# EAGLE schematic Adafruit Feather M0 RFMxx (EAGLE 9.6.2)
COMPANY: ADAFRUIT INDUSTRIES; DRAWN: KTOWN; REV: B
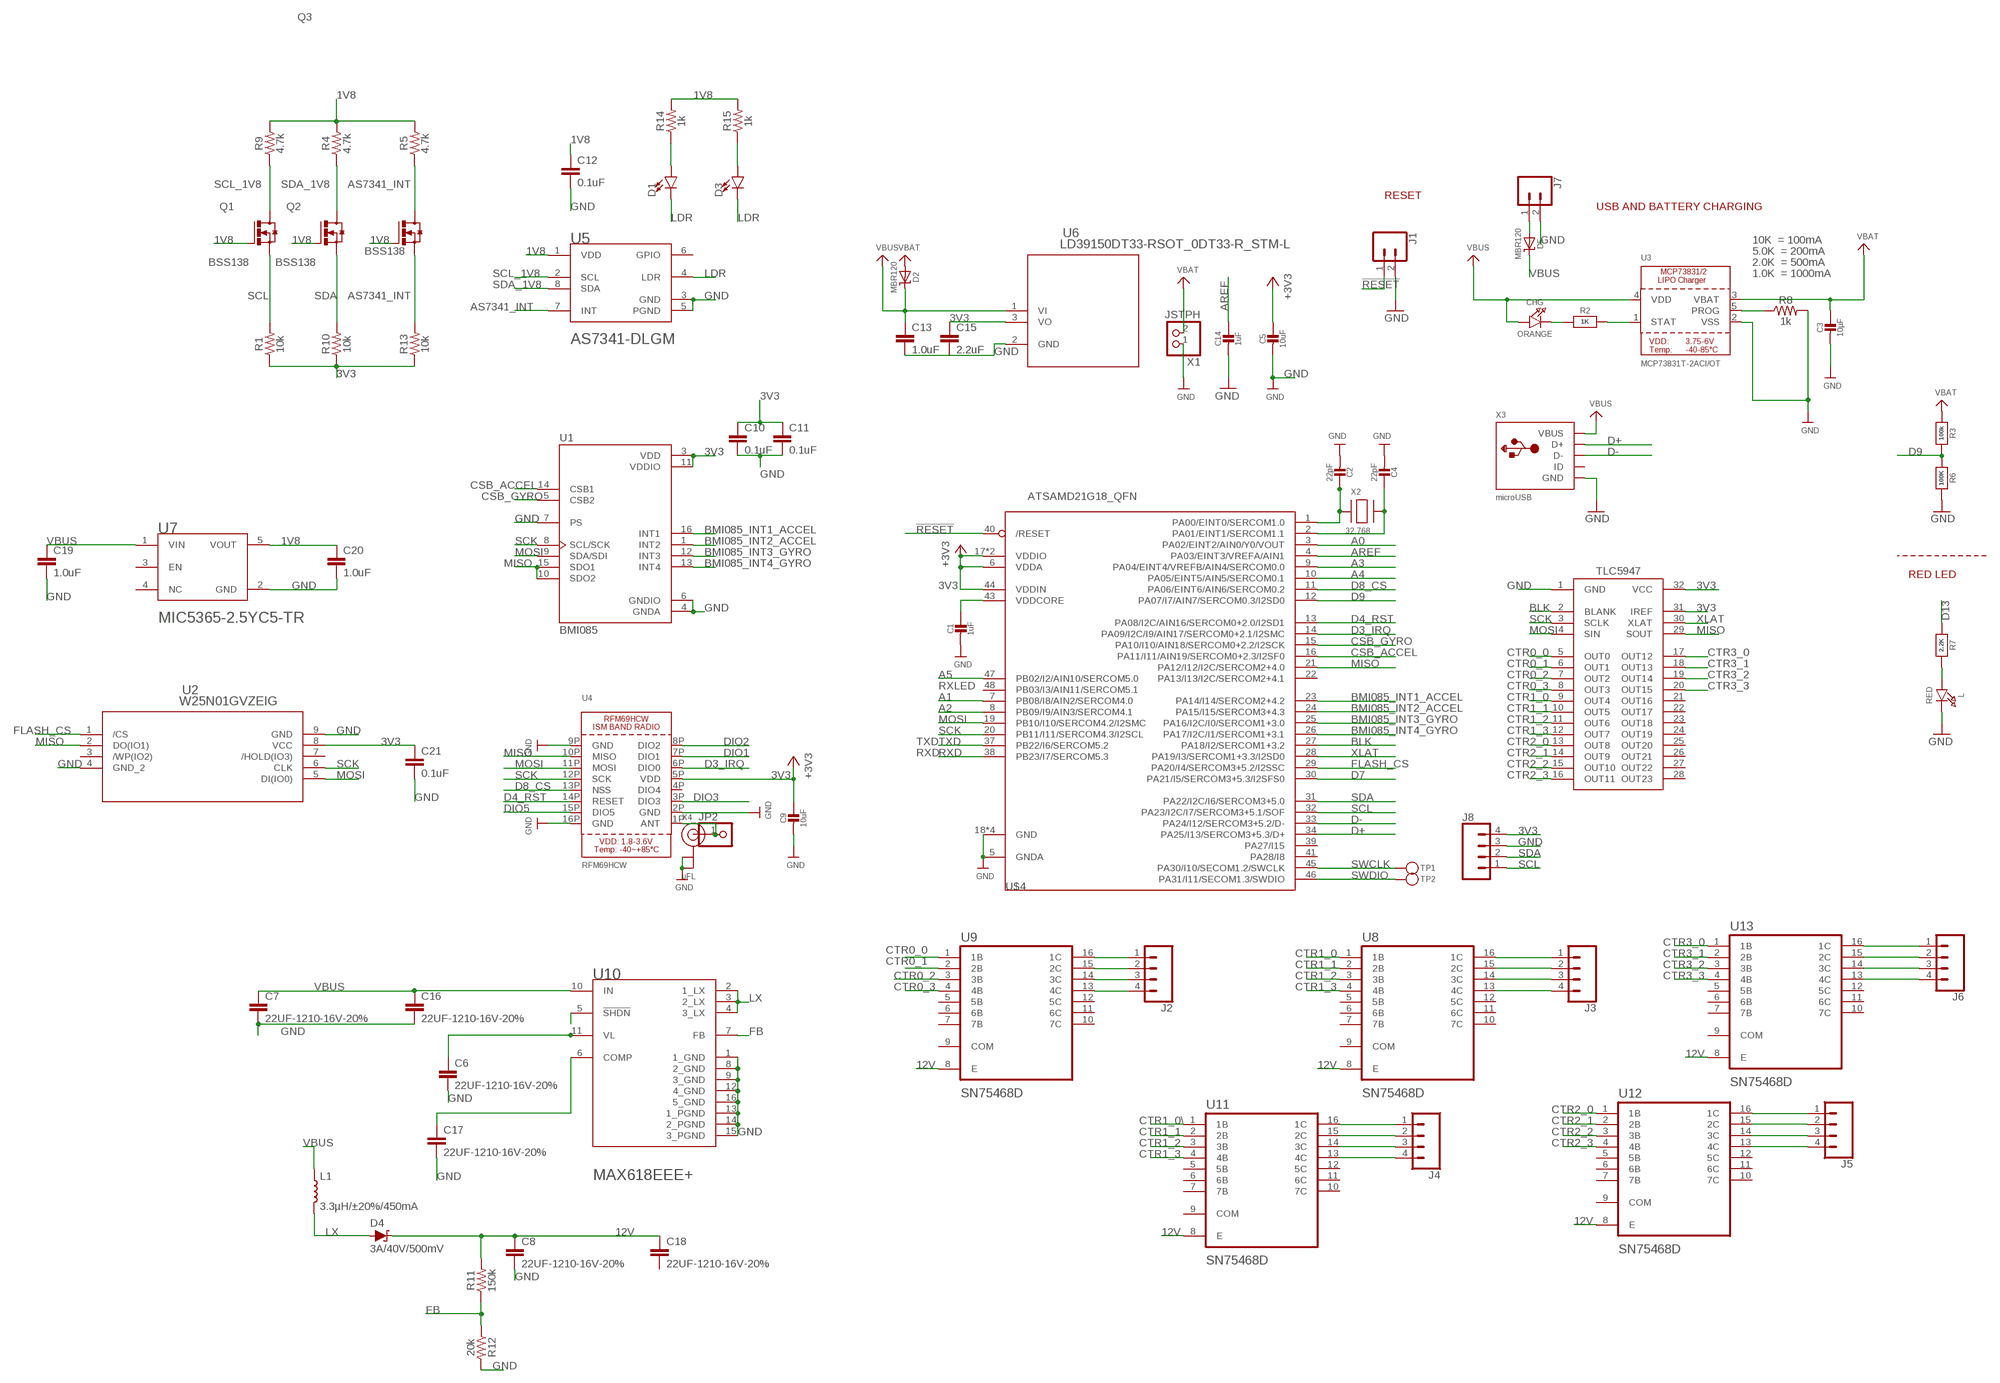
[diagram p0: schematic, sheet 1]

## Parts
C1  1uF  CAP_CERAMIC0603_NO  [0603-NO]
C2  22pF  CAP_CERAMIC0603_NO  [0603-NO]
C3  10µF  CAP_CERAMIC0805-NOOUTLINE  [0805-NO]
C4  22pF  CAP_CERAMIC0603_NO  [0603-NO]
C5  10uF  CAP_CERAMIC0805-NOOUTLINE  [0805-NO]
C6  22UF-1210-16V-20%  [1210]
C7  22UF-1210-16V-20%  [1210]
C8  22UF-1210-16V-20%  [1210]
C9  10uF  CAP_CERAMIC0805-NOOUTLINE  [0805-NO]
C10  0.1uF  0.1UF-0603-25V-5%  [0603]
C11  0.1uF  0.1UF-0603-25V-5%  [0603]
C12  0.1uF  0.1UF-0603-25V-5%  [0603]
C13  1.0uF  1.0UF-0805-25V-(+80/-20%)  [0805]
C14  1uF  CAP_CERAMIC0603_NO  [0603-NO]
C15  2.2uF  2.2UF-0805-25V-(+80/-20%)  [0805]
C16  22UF-1210-16V-20%  [1210]
C17  22UF-1210-16V-20%  [1210]
C18  22UF-1210-16V-20%  [1210]
C19  1.0uF  1.0UF-0805-25V-(+80/-20%)  [0805]
C20  1.0uF  1.0UF-0805-25V-(+80/-20%)  [0805]
C21  0.1uF  0.1UF-0603-100V-10%  [0603]
CHG  ORANGE  LED0805_NOOUTLINE  [CHIPLED_0805_NOOUTLINE]
D1  LED1206  [LED-1206]
D2  MBR120  DIODE-SCHOTTKYSOD-123  [SOD-123]
D3  LED1206  [LED-1206]
D4  3A/40V/500mV  DIODE-SCHOTTKY-B340A  [SMA-DIODE]
D5  MBR120  DIODE-SCHOTTKYSOD-123  [SOD-123]
IC1  TLC5947-DAP  [HTSSOP32DAP]
J1  CONN_02  [1X02]
J2  CONN_04  [1X04]
J3  CONN_04  [1X04]
J4  CONN_04  [1X04]
J5  CONN_04  [1X04]
J6  CONN_04  [1X04]
J7  CONN_02  [1X02]
J8  CONN_04  [1X04]
JP2  HEADER-1X1ROUND  [1X01_ROUND]
L  RED  LED0805_NOOUTLINE  [CHIPLED_0805_NOOUTLINE]
L1  3.3µH/±20%/450mA  INDUCTOR-0805-3.3UH  [0805]
Q1  BSS138  [SOT23-3]
Q2  BSS138  [SOT23-3]
Q3  BSS138  [SOT23-3]
R1  10k  10KOHM-0603-1/10W-1%  [0603]
R2  1K  RESISTOR_0603_NOOUT  [0603-NO]
R3  100k  RESISTOR_0603_NOOUT  [0603-NO]
R4  4.7k  4.7KOHM-0603-1/10W-1%  [0603]
R5  4.7k  4.7KOHM-0603-1/10W-1%  [0603]
R6  100K  RESISTOR_0603_NOOUT  [0603-NO]
R7  2.2K  RESISTOR_0603_NOOUT  [0603-NO]
R8  1k  1KOHM-0603-1/10W-1%  [0603]
R9  4.7k  4.7KOHM-0603-1/10W-1%  [0603]
R10  10k  10KOHM-0603-1/10W-1%  [0603]
R11  150k  150KOHM-0603-1/10W-1%  [0603]
R12  20k  20KOHM-0603-1/10W-1%  [0603]
R13  10k  10KOHM-0603-1/10W-1%  [0603]
R14  1k  1KOHM-0603-1/10W-1%  [0603]
R15  1k  1KOHM-0603-1/10W-1%  [0603]
TP1  TESTPOINTROUND1.5MM  [TESTPOINT_ROUND_1.5MM]
TP2  TESTPOINTROUND1.5MM  [TESTPOINT_ROUND_1.5MM]
U1  BMI085  [PQFN50P450X300X100-16N]
U2  W25N01GVZEIG  [WSON-8_6X5_WIN]
U3  MCP73831T-2ACI/OT  MCP73831/2  [SOT23-5]
U4  RFM69HCW  RFM69HCW_SMT  [RFMHCW_SMT]
U5  AMS_AS7341-DLGMAMS_AS7341-DLGM_0_0  [AMS_AS7341-DLGM_0]
U6  LD39150DT33-RSOT_0DT33-R_STM-L  [SOT_0DT33-R_STM-L]
U7  MICROCHIP_MIC5365-2_5YC5-TRMICROCHIP_MIC5365-2_5YC5-TR_0_0  [MICROCHIP_MIC5365-2_5YC5-TR_0]
U8  SN75468D  [SOIC127P600X175-16N]
U9  SN75468D  [SOIC127P600X175-16N]
U10  MAXIM_MAX618EEE+MAXIM_MAX618EEE+_0_0  [MAXIM_MAX618EEE+_0]
U11  SN75468D  [SOIC127P600X175-16N]
U12  SN75468D  [SOIC127P600X175-16N]
U13  SN75468D  [SOIC127P600X175-16N]
U$4  ATSAMD21G18_QFN  ATSAMD21J_QFN  [TQFN48_7MM]
X1  JSTPH  CON_JST_PH_2PIN  [JSTPH2]
X2  32.768  XTAL-3.2X1.5  [XTAL3215]
X3  microUSB  USB_MICRO_20329_V2  [4UCONN_20329_V2]
X4  uFL  ANTENNA_U.FL  [U.FL]

## Nets
1V8: C12.1 C20.1 Q1.1(G) Q2.1(G) Q3.1(G) R4.2 R5.2 R9.2 R14.2 R15.2 U5.1(VDD) U7.5(VOUT)
3V3: C5.1 C9.1 C10.1 C11.1 C15.1 C21.1 IC1.31(IREF) IC1.32(VCC) J8.4 R1.1 R10.1 R13.1 U1.3(VDD) U1.11(VDDIO) U2.8(VCC) U4.5P(VDD) U6.3(VO) U$4.6(VDDA) U$4.17(VDDIO) U$4.36(VDDIO) U$4.44(VDDIN) ; supply symbol labelled +3V3
12V: C8.1 C18.1 D4.C R11.2 U8.8(E) U9.8(E) U11.8(E) U12.8(E) U13.8(E)
!RESET: J1.1 U$4.40(/RESET)
A0: U$4.3(PA02/EINT2/AIN0/Y0/VOUT)
A1: U$4.7(PB08/I8/AIN2/SERCOM4.0)
A2: U$4.8(PB09/I9/AIN3/SERCOM4.1)
A3: U$4.9(PA04/EINT4/VREFB/AIN4/SERCOM0.0)
A4: U$4.10(PA05/EINT5/AIN5/SERCOM0.1)
A5: U$4.47(PB02/I2/AIN10/SERCOM5.0)
ANT: JP2.1 U4.1P(ANT) X4.3(SIGNAL)
AREF: C14.1 U$4.4(PA03/EINT3/VREFA/AIN1)
AS7341_INT: Q3.2(S) Q3.3(D) R5.1 R13.2 U5.7(INT)
BLK: IC1.2(BLANK) U$4.27(PA18/I2/SERCOM1+3.2)
BMI085_INT1_ACCEL: U1.16(INT1) U$4.23(PA14/I14/SERCOM2+4.2)
BMI085_INT2_ACCEL: U1.1(INT2) U$4.24(PA15/I15/SERCOM3+4.3)
BMI085_INT3_GYRO: U1.12(INT3) U$4.25(PA16/I2C/I0/SERCOM1+3.0)
BMI085_INT4_GYRO: U1.13(INT4) U$4.26(PA17/I2C/I1/SERCOM1+3.1)
CSB_ACCEL: U1.14(CSB1) U$4.16(PA11/I11/AIN19/SERCOM0+2.3/I2SF0)
CSB_GYRO: U1.5(CSB2) U$4.15(PA10/I10/AIN18/SERCOM0+2.2/I2SCK)
CTR0_0: IC1.5(OUT0) U9.1(1B)
CTR0_1: IC1.6(OUT1) U9.2(2B)
CTR0_2: IC1.7(OUT2) U9.3(3B)
CTR0_3: IC1.8(OUT3) U9.4(4B)
CTR1_0: IC1.9(OUT4) U8.1(1B)
CTR1_0\: U11.1(1B)
CTR1_1: IC1.10(OUT5) U8.2(2B) U11.2(2B)
CTR1_2: IC1.11(OUT6) U8.3(3B) U11.3(3B)
CTR1_3: IC1.12(OUT7) U8.4(4B) U11.4(4B)
CTR2_0: IC1.13(OUT8) U12.1(1B)
CTR2_1: IC1.14(OUT9) U12.2(2B)
CTR2_2: IC1.15(OUT10) U12.3(3B)
CTR2_3: IC1.16(OUT11) U12.4(4B)
CTR3_0: IC1.17(OUT12) U13.1(1B)
CTR3_1: IC1.18(OUT13) U13.2(2B)
CTR3_2: IC1.19(OUT14) U13.3(3B)
CTR3_3: IC1.20(OUT15) U13.4(4B)
D3_IRQ: U4.6P(DIO0) U$4.14(PA09/I2C/I9/AIN17/SERCOM0+2.1/I2SMC)
D4_RST: U4.14P(RESET) U$4.13(PA08/I2C/AIN16/SERCOM0+2.0/I2SD1)
D7: U$4.30(PA21/I5/SERCOM3+5.3/I2SFS0)
D8_CS: U4.13P(NSS) U$4.11(PA06/EINT6/AIN6/SERCOM0.2)
D9: R3.2 R6.1 U$4.12(PA07/I7/AIN7/SERCOM0.3/I2SD0)
D13: R7.1
D+: U$4.34(PA25/I13/SERCOM3+5.3/D+) X3.D+
D-: U$4.33(PA24/I12/SERCOM3+5.2/D-) X3.D-
DIO1: U4.7P(DIO1)
DIO2: U4.8P(DIO2)
DIO3: U4.3P(DIO3)
DIO5: U4.15P(DIO5)
FB: R11.1 R12.1 U10.7(FB)
FLASH_CS: U2.1(/CS) U$4.29(PA20/I4/SERCOM3+5.2/I2SSC)
GND: C1.2 C2.2 C3.2 C4.2 C5.2 C6.2 C7.2 C8.2 C9.2 C10.2 C11.2 C12.2 C13.2 C14.2 C15.2 C16.2 C17.2 C19.2 C20.2 C21.2 IC1.1(GND) J1.2 J7.2 J8.3 L.C R6.2 R8.2 R12.2 U1.4(GNDA) U1.6(GNDIO) U1.7(PS) U2.4(GND_2) U2.9(GND) U3.2(VSS) U4.2P(GND) U4.9P(GND) U4.16P(GND) U5.3(GND) U5.5(PGND) U6.2(GND) U7.2(GND) U10.1(1_GND) U10.8(2_GND) U10.9(3_GND) U10.12(4_GND) U10.13(1_PGND) U10.14(2_PGND) U10.15(3_PGND) U10.16(5_GND) U$4.5(GNDA) U$4.18(GND) U$4.35(GND) U$4.42(GND) U$4.THERMAL(GND) X1.1 X3.BASE@1(GND) X3.BASE@2(GND) X3.GND X3.SPRT@1(GND) X3.SPRT@2(GND) X3.SPRT@3(GND) X3.SPRT@4(GND) X4.1(GND) X4.2(GND)
LDR: D1.C D3.C U5.4(LDR)
LX: D4.A L1.2 U10.2(1_LX) U10.3(2_LX) U10.4(3_LX)
MISO: IC1.29(SOUT) U1.10(SDO2) U1.15(SDO1) U2.2(DO(IO1)) U4.10P(MISO) U$4.21(PA12/I12/I2C/SERCOM2+4.0)
MOSI: IC1.4(SIN) U1.9(SDA/SDI) U2.5(DI(IO0)) U4.11P(MOSI) U$4.19(PB10/I10/SERCOM4.2/I2SMC)
N$1: CHG.C R2.1
N$2: L.A R7.2
N$3: R2.2 U3.1(STAT)
N$4: R8.1 U3.5(PROG)
N$5: C2.1 U$4.1(PA00/EINT0/SERCOM1.0) X2.P$1
N$6: D1.A R14.1
N$7: C4.1 U$4.2(PA01/EINT1/SERCOM1.1) X2.P$2
N$8: D3.A R15.1
N$9: C6.1 U10.11(VL)
N$10: C17.1 U10.6(COMP)
N$11: U10.5(!SHDN!)
N$12: J3.1 U8.16(1C)
N$13: J3.2 U8.15(2C)
N$14: J3.3 U8.14(3C)
N$15: J3.4 U8.13(4C)
N$16: J2.1 U9.16(1C)
N$17: J2.2 U9.15(2C)
N$18: J2.3 U9.14(3C)
N$19: J2.4 U9.13(4C)
N$20: J4.1 U11.16(1C)
N$21: J4.2 U11.15(2C)
N$22: J4.3 U11.14(3C)
N$23: J4.4 U11.13(4C)
N$24: J5.1 U12.16(1C)
N$25: J5.2 U12.15(2C)
N$26: J5.3 U12.14(3C)
N$27: J5.4 U12.13(4C)
N$28: J6.1 U13.16(1C)
N$29: J6.2 U13.15(2C)
N$30: J6.3 U13.14(3C)
N$31: J6.4 U13.13(4C)
N$32: D5.A J7.1
RXD: U$4.38(PB23/I7/SERCOM5.3)
SCK: IC1.3(SCLK) U1.8(SCL/SCK) U2.6(CLK) U4.12P(SCK) U$4.20(PB11/I11/SERCOM4.3/I2SCL)
SCL: J8.1 Q1.2(S) R1.2 U$4.32(PA23/I2C/I7/SERCOM3+5.1/SOF)
SCL_1V8: Q1.3(D) R9.1 U5.2(SCL)
SDA: J8.2 Q2.2(S) R10.2 U$4.31(PA22/I2C/I6/SERCOM3+5.0)
SDA_1V8: Q2.3(D) R4.1 U5.8(SDA)
SWCLK: TP1.P$1 U$4.45(PA30/I10/SECOM1.2/SWCLK)
SWDIO: TP2.P$1 U$4.46(PA31/I11/SECOM1.3/SWDIO)
TXD: U$4.37(PB22/I6/SERCOM5.2)
VBAT: C3.1 D2.A R3.1 U3.3(VBAT) X1.2
VBUS: C7.1 C13.1 C16.1 C19.1 CHG.A D2.C D5.C L1.1 U3.4(VDD) U6.1(VI) U7.1(VIN) U10.10(IN) X3.VBUS
VDDCORE: C1.1 U$4.43(VDDCORE)
XLAT: IC1.30(XLAT) U$4.28(PA19/I3/SERCOM1+3.3/I2SD0)
Unconnected: C18.2 IC1.21(OUT16) IC1.22(OUT17) IC1.23(OUT18) IC1.24(OUT19) IC1.25(OUT20) IC1.26(OUT21) IC1.27(OUT22) IC1.28(OUT23) IC1.EXP(PAD) U2.3(/WP(IO2)) U2.7(/HOLD(IO3)) U4.4P(DIO4) U5.6(GPIO) U7.3(EN) U7.4(NC) U8.5(5B) U8.6(6B) U8.7(7B) U8.9(COM) U8.10(7C) U8.11(6C) U8.12(5C) U9.5(5B) U9.6(6B) U9.7(7B) U9.9(COM) U9.10(7C) U9.11(6C) U9.12(5C) U11.5(5B) U11.6(6B) U11.7(7B) U11.9(COM) U11.10(7C) U11.11(6C) U11.12(5C) U12.5(5B) U12.6(6B) U12.7(7B) U12.9(COM) U12.10(7C) U12.11(6C) U12.12(5C) U13.5(5B) U13.6(6B) U13.7(7B) U13.9(COM) U13.10(7C) U13.11(6C) U13.12(5C) U$4.22(PA13/I13/I2C/SERCOM2+4.1) U$4.39(PA27/I15) U$4.41(PA28/I8) U$4.48(PB03/I3/AIN11/SERCOM5.1) X3.ID

## Notes on the sheet
- RESET
- USB AND BATTERY CHARGING
- 10K  = 100mA
- 5.0K  = 200mA
- 2.0K  = 500mA
- 1.0K  = 1000mA
- RED LED
- RXLED
- TXD
- RXD

## Library data of the parts
C1-C5 C9 C14 = microbuilder:CAP_CERAMIC: Ceramic Capacitors For new designs, use the packages preceded by an '_' character since they are more reliable: The following footprints should be used on most boards: _0402 - Standard footprint for regular board layouts _0603 - Standard footprint for regular board layouts _0805 - Standard footprint for regular board layouts _1206 - Standard footprint for regular board layouts For extremely tight-pitch boards where space is at a premium, the following 'micro-pitch' footprints can be used (smaller pads, no silkscreen outline, etc.): _0402MP - Micro-pitch footprint for very dense/compact boards _0603MP - Micro-pitch footprint for very dense/compact boards _0805MP - Micro-pitch footprint for very dense/compact boards _1206MP - Micro-pitch footprint for very dense/compact boards
C6-C8 C16-C18 = SparkFun-Capacitors:22UF: 22µF ceramic capacitors A capacitor is a passive two-terminal electrical component used to store electrical energy temporarily in an electric field.
C10-C12 = SparkFun-Capacitors:0.1UF: 0.1µF ceramic capacitors A capacitor is a passive two-terminal electrical component used to store electrical energy temporarily in an electric field.; PROD_ID: CAP-08604
C13 C19 C20 = SparkFun-Capacitors:1.0UF: 1µF ceramic capacitors A capacitor is a passive two-terminal electrical component used to store electrical energy temporarily in an electric field.; PROD_ID: CAP-11625
C15 = SparkFun-Capacitors:2.2UF: 2.2µF ceramic capacitors A capacitor is a passive two-terminal electrical component used to store electrical energy temporarily in an electric field.; PROD_ID: CAP-11624
C21 = SparkFun-Capacitors:0.1UF: 0.1µF ceramic capacitors A capacitor is a passive two-terminal electrical component used to store electrical energy temporarily in an electric field.; PROD_ID: CAP-08390
CHG L = microbuilder:LED: LED 0603 - 0603 Surface Mount Package 2mA: Green LED - Low Power (3.9mcd, 2ma, 1.7Vf) - Digikey: 475-2709-2-ND Orange LED - Low Power (9.8mcd, 2ma, 1.8Vf) - Digikey: 475-1194-2-ND Red LED - Low Power (5mcd, 2ma, 1.8Vf) - Digikey: 475-1195-2-ND Yellow LED - Low Power (7mcd, 2ma, 1.8Vf) - Digikey: 475-1196-2-ND 5mA: Blue LED - Low Power (17mcd, 5ma, 2.9Vf) - Digikey: LNJ937W8CRACT-ND 0805 - 0805 Surface Mount Package 2mA: Red LED (8.8mcd, 2mA, 1.8Vf, Clear) - Low Power [Digikey: 475-2510-1-ND] Green LED (5mcd, 2mA, 1.8Vf, Clear) - Low Power [Digikey: 475-2730-1-ND] Yellow LED (11.3mcd, 2mA, 1.8Vf, Clear) - Low Power [Digikey: 475-2555-1-ND] 20mA: Red LED (104mcd, 20mA, Diffused) - LS R976 [Digikey: 475-1278-6-ND] Red LED (12mcd, 20mA, 2.0Vf, Clear) - APT2012EC [Digikey: 754-1128-1-ND] Green LED (15mcd, 20mA, 2.2Vf, Clear) - APT2012GC [Digikey: 754-1131-1-ND] Orange LED (160mcd, 20mA, 2.1Vf, Clear) - APT2012SECK [Digikey: 754-1130-1-ND] 1206 - 1206 Surface Mount Package Green LED (26mcd, 20mA, Diffused) - LG N971 [Digikey: 475-1407-6-ND] Red LED (15mcd, 20mA, Diffused) - LH N974 [Digikey: 475-1416-6-ND] Cree - Cree High-Power Surface Mount LEDs XPEBWT-L1-0000-00D50 - White 111lm 350mA 2.9Vf 6200K 110° XTEAWT-00-0000-00000LEE3 - White 114lm 350mA 2.85Vf 5000K 115° Everlight - Everlight 45-21 Series Surface Mount LEDs 45-21/QK2C-B2832AC2CB2/2T - Warm White 2000mcd 20mA 3.25Vf 3050K 120° 45-21/LK2C-B38452C4CB2/2T - Nuetral White 2000mcd 20mA 3.25Vf 4150K 120° 45-21/LK2C-B50634C6CB2/2T - Cold White 2200mcd 20mA 3.25Vf 5650K 120° PLCC2 Reverse Mount LS T77K-J1L2-1-0-2-R18-Z - Red 11.25mcd 2mA 1.8Vf 630nm 120° LO T77K-L1M2-24-Z - Orange 19.6mcd 2mA 1.8Vf 606nm 120° LY T77K-K2M1-26-Z - Yellow 15.7mcd 2mA 1.8Vf 587nm 120°
D1 D3 = SparkFun-LED:LED: LED (Generic) Standard schematic elements and footprints for 5mm, 3mm, 1206, and 0603 sized LEDs. Generic LEDs with no color specified.
D2 D5 = microbuilder:DIODE-SCHOTTKY
D4 = SparkFun-DiscreteSemi:DIODE-SCHOTTKY: Schottky diode A Schottky diode is a semiconductor diode which has a low forward voltage drop and a very fast switching action.; PROD_ID: DIO-09886
IC1 = TLC5947:TLC5947: Check availability <https://pricing.snapeda.com/parts/TLC5947/Texas%20Instruments/view-part?ref=eda>; AVAILABILITY: In Stock; DESCRIPTION: LED Driver IC 24 Output Linear Shift Register - Dimming 30mA 32-VQFN (5x5); MF: Texas Instruments; MP: TLC5947; PACKAGE: None; PRICE: None; PURCHASE-URL: https://pricing.snapeda.com/search/part/TLC5947/?ref=eda
J1 J7 = SparkFun-Connectors:CONN_02: Multi connection point. Often used as Generic Header-pin footprint for 0.1 inch spaced/style header connections On any of the 0.1 inch spaced packages, you can populate with these: Break Away Headers - Straight <https://www.sparkfun.com/products/116> (PRT-00116) Break Away Male Headers - Right Angle <https://www.sparkfun.com/products/553> (PRT-00553) Female Headers <https://www.sparkfun.com/products/115> (PRT-00115) Break Away Headers - Machine Pin <https://www.sparkfun.com/products/117> (PRT-00117) Break Away Female Headers - Swiss Machine Pin <https://www.sparkfun.com/products/743> (PRT-00743) For SCREWTERMINALS and SPRING TERMINALS visit here: Screw Terimnals on SparkFun.com <https://www.sparkfun.com/search/results?term=Screw+Terminals> (5mm/3.5mm/2.54mm spacing) This device is also useful as a general connection point to wire up your design to another part of your project. Our various solder wires solder well into these plated through hole pads. Hook-Up Wire - Assortment (Stranded, 22 AWG) <https://www.sparkfun.com/products/11375> (PRT-11375) Hook-Up Wire - Assortment (Solid Core, 22 AWG) <https://www.sparkfun.com/products/11367> (PRT-11367) View the entire wire category on our website here <https://www.sparkfun.com/categories/141> Special notes: Molex polarized connector foot print use with: PRT-08233 with associated crimp pins and housings. 2.54_SCREWTERM for use with PRT-10571. 3.5mm Screw Terminal footprints for PRT-08084 5mm Screw Terminal footprints for use with PRT-08432
J2-J6 J8 = SparkFun-Connectors:CONN_04: Multi connection point. Often used as Generic Header-pin footprint for 0.1 inch spaced/style header connections On any of the 0.1 inch spaced packages, you can populate with these: Break Away Headers - Straight <https://www.sparkfun.com/products/116> (PRT-00116) Break Away Male Headers - Right Angle <https://www.sparkfun.com/products/553> (PRT-00553) Female Headers <https://www.sparkfun.com/products/115> (PRT-00115) Break Away Headers - Machine Pin <https://www.sparkfun.com/products/117> (PRT-00117) Break Away Female Headers - Swiss Machine Pin <https://www.sparkfun.com/products/743> (PRT-00743) For SCREWTERMINALS and SPRING TERMINALS visit here: Screw Terimnals on SparkFun.com <https://www.sparkfun.com/search/results?term=Screw+Terminals> (5mm/3.5mm/2.54mm spacing) This device is also useful as a general connection point to wire up your design to another part of your project. Our various solder wires solder well into these plated through hole pads. Hook-Up Wire - Assortment (Stranded, 22 AWG) <https://www.sparkfun.com/products/11375> (PRT-11375) Hook-Up Wire - Assortment (Solid Core, 22 AWG) <https://www.sparkfun.com/products/11367> (PRT-11367) View the entire wire category on our website here <https://www.sparkfun.com/categories/141> Special notes: Molex polarized connector foot print use with SKU : PRT-08231 with associated crimp pins and housings. 1MM SMD Version SKU: PRT-10208; PROD_ID: CONN-09696
JP2 = microbuilder:HEADER-1X1: PIN HEADER
L1 = SparkFun-Coils:INDUCTOR: Inductors Resist changes in electrical current. Basically a coil of wire. SparkFun Products: SparkFun Load Cell Amplifier - HX711 <https://www.sparkfun.com/products/13879> IOIO-OTG - V2.2 <https://www.sparkfun.com/products/13613>; PROD_ID: NDUC-13076
Q1-Q3 = Transistor:BSS138: MOSFET N-CH 50V 220MA SOT-23 Manufacturer's datasheet <https://www.onsemi.com/pub/Collateral/BSS138-D.PDF>; CREATED_BY: PCBLayout.com; DIGIKEY_PART_NUMBER: BSS138CT-ND; MANUFACTURER: ON Semiconductor; MPN: BSS138; PACKAGE: SOT-23
R1 R10 R13 = SparkFun-Resistors:10KOHM: 10kΩ resistor A resistor is a passive two-terminal electrical component that implements electrical resistance as a circuit element. Resistors act to reduce current flow, and, at the same time, act to lower voltage levels within circuits. - Wikipedia; PROD_ID: RES-00824
R2 R3 R6 R7 = microbuilder:RESISTOR: Resistors For new designs, use the packages preceded by an '_' character since they are more reliable: The following footprints should be used on most boards: _0402 - Standard footprint for regular board layouts _0603 - Standard footprint for regular board layouts _0805 - Standard footprint for regular board layouts _1206 - Standard footprint for regular board layouts For extremely tight-pitch boards where space is at a premium, the following 'micro-pitch' footprints can be used (smaller pads, no silkscreen outline, etc.): _0402MP - Micro-pitch footprint for very dense/compact boards _0603MP - Micro-pitch footprint for very dense/compact boards _0805MP - Micro-pitch footprint for very dense/compact boards _1206MP - Micro-pitch footprint for very dense/compact boards
R4 R5 R9 = SparkFun-Resistors:4.7KOHM: 4.7kΩ resistor A resistor is a passive two-terminal electrical component that implements electrical resistance as a circuit element. Resistors act to reduce current flow, and, at the same time, act to lower voltage levels within circuits. - Wikipedia; PROD_ID: RES-07857
R8 R14 R15 = SparkFun-Resistors:1KOHM: 1kΩ resistor A resistor is a passive two-terminal electrical component that implements electrical resistance as a circuit element. Resistors act to reduce current flow, and, at the same time, act to lower voltage levels within circuits. - Wikipedia; PROD_ID: RES-07856
R11 = SparkFun-Resistors:150KOHM: 150kΩ resistor A resistor is a passive two-terminal electrical component that implements electrical resistance as a circuit element. Resistors act to reduce current flow, and, at the same time, act to lower voltage levels within circuits. - Wikipedia; PROD_ID: RES-09117
R12 = SparkFun-Resistors:20KOHM: 20kΩ resistor A resistor is a passive two-terminal electrical component that implements electrical resistance as a circuit element. Resistors act to reduce current flow, and, at the same time, act to lower voltage levels within circuits. - Wikipedia; PROD_ID: RES-09383
TP1 TP2 = microbuilder:TESTPOINT: Test Point Various test points for characterisation and PCB testing TESTPOINT_SMT - Compact Surface Mount Test Point [Digikey: 5016KTR-ND]
U1 = BMI085:BMI085: High-performance 6-axis IMU designed for Augmented/Virtual Reality applications Check availability <https://pricing.snapeda.com/parts/BMI085/Bosch%20Sensortec/view-part?ref=eda>; AVAILABILITY: In Stock; DESCRIPTION: Accelerometer, Gyroscope, 6 Axis Sensor I²C, SPI Output; MF: Bosch Sensortec; MP: BMI085; PACKAGE: VFLGA-16 Bosch Tools; PRICE: None; PURCHASE-URL: https://pricing.snapeda.com/search/part/BMI085/?ref=eda
U2 = flashChip:W25N01GVZEIG; COPYRIGHT: Copyright (C) 2021 Ultra Librarian. All rights reserved.; MANUFACTURER_PART_NUMBER: W25N01GVZEIG; MFR_NAME: Winbond
U3 = microbuilder:MCP73831/2: MCP73831/2 LIPO Charger VDD: 3.75 - 6V Temp -40 - 85°C Programmable Charge Rate: 15-500mA NOTE: STAT is a tri-state logic output on the MCP73831 and an open-drain output on the MCP73832. SOT23-5 with 4.2V output and tri-state logic on STAT = MCP73831T-2ACI/OT
U4 = microbuilder:RFM69HCW: RFM69HCW - ISM Band RF Transceiver
U5 = ams - AS7341-DLGM:AMS_AS7341-DLGM: Light to Frequency Ambient Light Sensor Digital-I2C-OUT 8-Pin OLGA T/R; AMBIENT_TEMPERATURE_RANGE_HIGH: +70°C; AMBIENT_TEMPERATURE_RANGE_LOW: -30°C; AUTOMOTIVE: No; CENTROID_NOT_SPECIFIED: No; DATASHEET: https://media.digikey.com/pdf/Data%20Sheets/Austriamicrosystems%20PDFs/AS7341_DS.pdf; DEVICE_CLASS_L1: Sensors; DEVICE_CLASS_L2: Optical Sensors; DEVICE_CLASS_L3: unset; DIGIKEY_DESCRIPTION: SENSOR AMBIENT LIGHT; DIGIKEY_PART_NUMBER: AS7341-DLGMCT-ND; FOOTPRINT_VARIANT_NAME_0: Recommended_Land_Pattern; HEIGHT: 1.1mm; LEAD_FREE: Yes; MAX_SUPPLY_VOLTAGE: 2V; MF: ams; MFG_PACKAGE_IDENT: 0; MFG_PACKAGE_IDENT_DATE: 0; MFG_PACKAGE_IDENT_REV: 0; MIN_SUPPLY_VOLTAGE: 1.7V; MOUSER_DESCRIPTION: AS7341 Series 11-Channel Spectral Color Ambient Light Sensor - OLGA-8; MOUSER_PART_NUMBER: 985-AS7341-DLGM; MPN: AS7341-DLGM; OPERATING_SUPPLY_CURRENT: 0.7-210uA; PACKAGE: OLGA8; PIN_0_0_4_INSIDE_EDGE: clock; PREFIX: U; ROHS: Yes; SENSOR_OUTPUT: I2C; TEMPERATURE_RANGE_HIGH: +70°C; TEMPERATURE_RANGE_LOW: -30°C; VERIFICATION_VERSION: 0.0.0.3
U6 = 2022-03-14_02-05-07_Library:LD39150DT33-R; COPYRIGHT: Copyright (C) 2022 Ultra Librarian. All rights reserved.; MANUFACTURER_PART_NUMBER: LD39150DT33-R; MFR_NAME: STMicroelectronics
U7 = Microchip - MIC5365-2.5YC5-TR:MICROCHIP_MIC5365-2_5YC5-TR: Linear Voltage Regulator IC Positive Fixed 1 Output 2.5V 150mA SC-70-5; ACCURACY_PERCENTAGE: 2%; AUTOMOTIVE: No; CENTROID_NOT_SPECIFIED: No; DATASHEET: https://ww1.microchip.com/downloads/en/DeviceDoc/mic5365.pdf; DEVICE_CLASS_L1: Integrated Circuits (ICs); DEVICE_CLASS_L2: Power Management ICs; DEVICE_CLASS_L3: Voltage Regulators - Linear; DIGIKEY_DESCRIPTION: IC REG LINEAR 2.5V 150MA SC70-5; DIGIKEY_PART_NUMBER: 576-3185-1-ND; DROPOUT_VOLTAGE: 180mV; FOOTPRINT_PARAMETERS_1: {"fp_type":"SOT3X3","params":{"N":{"default":"5","long name":"Number of leads","type":"multichoice","short name":"N"},"A":{"nom":950000,"long name":"Height","min":800000,"max":1100000,"short name":"A","type":"measurement"},"A1":{"nom":50000,"long name":"Standoff height","min":0,"max":100000,"short name":"A1","type":"measurement"},"A2":{"nom":900000,"long name":"Package height","min":800000,"max":1000000,"short name":"A2","type":"measurement"},"D":{"nom":2025000,"long name":"Package length","min":1800000,"max":2250000,"short name":"D","type":"measurement"},"E":{"nom":2100000,"long name":"Width /w leads","min":1800000,"max":2400000,"short name":"E","type":"measurement"},"E1":{"nom":1250000,"long name":"Package width","min":1150000,"max":1350000,"short name":"E1","type":"measurement"},"B":{"nom":225000,"long name":"Lead width","min":150000,"max":300000,"short name":"B","type":"measurement"},"C":{"nom":190000,"long name":"Lead thickness","min":80000,"max":300000,"short name":"C","type":"measurement"},"L":{"nom":335000,"long name":"Lead foot length","min":210000,"max":460000,"short name":"L","type":"measurement"},"e":{"nom":650000,"long name":"Lead pitch","min":null,"max":null,"short name":"e","type":"measurement"},"PHI":{"nom":false,"long name":"Lead angle","min":0,"max":8,"short name":"PHI","type":"measurement"},"offset x":{"nom":0,"long name":"X Center offset","min":null,"max":null,"short name":"offset x","type":"measurement"},"offset y":{"nom":0,"long name":"Y Center offset","min":null,"max":null,"short name":"offset y","type":"measurement"},"LS":{"default":"Rounded rectangle","long name":"Land shape","type":"multichoice","short name":"LS"},"LS1":{"default":"Rectangle","long name":"Land shape (Pin 1)","type":"multichoice","short name":"LS1"},"solder toe":{"nom":550000,"long name":"Solder fillet (toe)","min":null,"max":null,"short name":"solder toe","type":"fixedmeasurement"},"solder heel":{"nom":450000,"long name":"Solder fillet (heel)","min":null,"max":null,"short name":"solder heel","type":"fixedmeasurement"},"solder side":{"nom":50000,"long name":"Solder fillet (side)","min":null,"max":null,"short name":"solder side","type":"fixedmeasurement"},"courtyard":{"nom":500000,"long name":"Courtyard","min":null,"max":null,"short name":"courtyard","type":"fixedmeasurement"},"SF":{"default":"A","long name":"Packing level","type":"multichoiceparent","short name":"SF","help":"http://support.upverter.com/customer/portal/articles/978783-what-is-a-footprint-packing-level","children":["solder toe","solder heel","solder side","courtyard"]}}}; FOOTPRINT_PARAMETERS_2: {"fp_type":"SOT3X3","params":{"N":{"default":"5","long name":"Number of leads","type":"multichoice","short name":"N"},"A":{"nom":950000,"long name":"Height","min":800000,"max":1100000,"short name":"A","type":"measurement"},"A1":{"nom":50000,"long name":"Standoff height","min":0,"max":100000,"short name":"A1","type":"measurement"},"A2":{"nom":900000,"long name":"Package height","min":800000,"max":1000000,"short name":"A2","type":"measurement"},"D":{"nom":2025000,"long name":"Package length","min":1800000,"max":2250000,"short name":"D","type":"measurement"},"E":{"nom":2100000,"long name":"Width /w leads","min":1800000,"max":2400000,"short name":"E","type":"measurement"},"E1":{"nom":1250000,"long name":"Package width","min":1150000,"max":1350000,"short name":"E1","type":"measurement"},"B":{"nom":225000,"long name":"Lead width","min":150000,"max":300000,"short name":"B","type":"measurement"},"C":{"nom":190000,"long name":"Lead thickness","min":80000,"max":300000,"short name":"C","type":"measurement"},"L":{"nom":335000,"long name":"Lead foot length","min":210000,"max":460000,"short name":"L","type":"measurement"},"e":{"nom":650000,"long name":"Lead pitch","min":null,"max":null,"short name":"e","type":"measurement"},"PHI":{"nom":false,"long name":"Lead angle","min":0,"max":8,"short name":"PHI","type":"measurement"},"offset x":{"nom":0,"long name":"X Center offset","min":null,"max":null,"short name":"offset x","type":"measurement"},"offset y":{"nom":0,"long name":"Y Center offset","min":null,"max":null,"short name":"offset y","type":"measurement"},"LS":{"default":"Rounded rectangle","long name":"Land shape","type":"multichoice","short name":"LS"},"LS1":{"default":"Rectangle","long name":"Land shape (Pin 1)","type":"multichoice","short name":"LS1"},"solder toe":{"nom":350000,"long name":"Solder fillet (toe)","min":null,"max":null,"short name":"solder toe","type":"fixedmeasurement"},"solder heel":{"nom":350000,"long name":"Solder fillet (heel)","min":null,"max":null,"short name":"solder heel","type":"fixedmeasurement"},"solder side":{"nom":30000,"long name":"Solder fillet (side)","min":null,"max":null,"short name":"solder side","type":"fixedmeasurement"},"courtyard":{"nom":250000,"long name":"Courtyard","min":null,"max":null,"short name":"courtyard","type":"fixedmeasurement"},"SF":{"default":"B","long name":"Packing level","type":"multichoiceparent","short name":"SF","help":"http://support.upverter.com/customer/portal/articles/978783-what-is-a-footprint-packing-level","children":["solder toe","solder heel","solder side","courtyard"]}}}; FOOTPRINT_PARAMETERS_3: {"fp_type":"SOT3X3","params":{"N":{"default":"5","long name":"Number of leads","type":"multichoice","short name":"N"},"A":{"nom":950000,"long name":"Height","min":800000,"max":1100000,"short name":"A","type":"measurement"},"A1":{"nom":50000,"long name":"Standoff height","min":0,"max":100000,"short name":"A1","type":"measurement"},"A2":{"nom":900000,"long name":"Package height","min":800000,"max":1000000,"short name":"A2","type":"measurement"},"D":{"nom":2025000,"long name":"Package length","min":1800000,"max":2250000,"short name":"D","type":"measurement"},"E":{"nom":2100000,"long name":"Width /w leads","min":1800000,"max":2400000,"short name":"E","type":"measurement"},"E1":{"nom":1250000,"long name":"Package width","min":1150000,"max":1350000,"short name":"E1","type":"measurement"},"B":{"nom":225000,"long name":"Lead width","min":150000,"max":300000,"short name":"B","type":"measurement"},"C":{"nom":190000,"long name":"Lead thickness","min":80000,"max":300000,"short name":"C","type":"measurement"},"L":{"nom":335000,"long name":"Lead foot length","min":210000,"max":460000,"short name":"L","type":"measurement"},"e":{"nom":650000,"long name":"Lead pitch","min":null,"max":null,"short name":"e","type":"measurement"},"PHI":{"nom":false,"long name":"Lead angle","min":0,"max":8,"short name":"PHI","type":"measurement"},"offset x":{"nom":0,"long name":"X Center offset","min":null,"max":null,"short name":"offset x","type":"measurement"},"offset y":{"nom":0,"long name":"Y Center offset","min":null,"max":null,"short name":"offset y","type":"measurement"},"LS":{"default":"Rounded rectangle","long name":"Land shape","type":"multichoice","short name":"LS"},"LS1":{"default":"Rectangle","long name":"Land shape (Pin 1)","type":"multichoice","short name":"LS1"},"solder toe":{"nom":150000,"long name":"Solder fillet (toe)","min":null,"max":null,"short name":"solder toe","type":"fixedmeasurement"},"solder heel":{"nom":250000,"long name":"Solder fillet (heel)","min":null,"max":null,"short name":"solder heel","type":"fixedmeasurement"},"solder side":{"nom":10000,"long name":"Solder fillet (side)","min":null,"max":null,"short name":"solder side","type":"fixedmeasurement"},"courtyard":{"nom":100000,"long name":"Courtyard","min":null,"max":null,"short name":"courtyard","type":"fixedmeasurement"},"SF":{"default":"C","long name":"Packing level","type":"multichoiceparent","short name":"SF","help":"http://support.upverter.com/customer/portal/articles/978783-what-is-a-footprint-packing-level","children":["solder toe","solder heel","solder side","courtyard"]}}}; FOOTPRINT_VARIANT_NAME_0: Recommended_Land_Pattern; FOOTPRINT_VARIANT_NAME_1: IPC_A; FOOTPRINT_VARIANT_NAME_2: IPC_B; FOOTPRINT_VARIANT_NAME_3: IPC_C; HEIGHT: 1.1mm; LEAD_FREE: Yes; MAX_JUNCTION_TEMP: +125°C; MAX_SUPPLY_VOLTAGE: 5.5V; MF: Microchip; MFG_PACKAGE_IDENT: SC70-5LD-PL-1; MFG_PACKAGE_IDENT_COMPONENT_ID: bf59aa73e637193d; MFG_PACKAGE_IDENT_DATE: 0; MFG_PACKAGE_IDENT_REV: 0; MIN_SUPPLY_VOLTAGE: 2.5V; MOUSER_DESCRIPTION: LDO Regulator Pos 2.5V 0.15A 5-Pin SC-70 T/R; MOUSER_PART_NUMBER: 998-MIC5365-2.5YC5TR; MPN: MIC5365-2.5YC5-TR; NOMINAL_SUPPLY_CURRENT: 29uA; NUMBER_OF_OUTPUTS: 1; OUTPUT_CURRENT: 150mA; OUTPUT_TYPE: Fixed; OUTPUT_VOLTAGE: 2.5V; PACKAGE: SC70-5; PREFIX: U; ROHS: Yes; STANDOFF_HEIGHT: 0mm; TEMPERATURE_RANGE_HIGH: +125°C; TEMPERATURE_RANGE_LOW: -40°C; VERIFICATION_VERSION: 0.0.0.3
U8 U9 U11-U13 = SN75468D:SN75468D: Check availability <https://pricing.snapeda.com/parts/SN75468D/Texas%20Instruments/view-part?ref=eda>; AVAILABILITY: In Stock; DESCRIPTION: 100-V, 7-ch darlington array with TTL or CMOS compatibility 16-SOIC 0 to 70; MF: Texas Instruments; MP: SN75468D; PACKAGE: SOIC-16 Texas Instruments; PRICE: None; PURCHASE-URL: https://pricing.snapeda.com/search/part/SN75468D/?ref=eda
U10 = Maxim - MAX618EEE+:MAXIM_MAX618EEE+: Boost Switching Regulator IC Positive Adjustable 3V 1 Output 1.4A (Switch) 16-SSOP (0.154", 3.90mm Width); AUTOMOTIVE: No; CENTROID_NOT_SPECIFIED: No; DATASHEET: https://datasheets.maximintegrated.com/en/ds/MAX618.pdf; DEVICE_CLASS_L1: Integrated Circuits (ICs); DEVICE_CLASS_L2: Power Management ICs; DEVICE_CLASS_L3: Voltage Regulators - Switching; DIGIKEY_DESCRIPTION: IC REG BOOST ADJ 1.4A 16QSOP; DIGIKEY_PART_NUMBER: MAX618EEE+-ND; FOOTPRINT_PARAMETERS_1: {"fp_type":"PSOP","params":{"N":{"nom":16,"long name":"Number of leads","min":null,"max":null,"short name":"N","type":"count"},"A":{"nom":1600000,"long name":"Height","min":1350000,"max":1750000,"short name":"A","type":"measurement"},"A1":{"nom":169000,"long name":"Package clearance","min":102000,"max":254000,"short name":"A1","type":"measurement"},"A2":{"nom":1431000,"long name":"Package height","min":1096000,"max":1648000,"short name":"A2","type":"measurement"},"D":{"nom":4900000,"long name":"Package length","min":4800000,"max":4980000,"short name":"D","type":"measurement"},"E":{"nom":6000000,"long name":"Width /w leads","min":5840000,"max":6200000,"short name":"E","type":"measurement"},"E1":{"nom":3890000,"long name":"Package width","min":3810000,"max":3990000,"short name":"E1","type":"measurement"},"B":{"nom":250000,"long name":"Lead width","min":200000,"max":300000,"short name":"B","type":"measurement"},"C":{"nom":222000,"long name":"Lead thickness","min":191000,"max":248999,"short name":"C","type":"measurement"},"L":{"nom":640000,"long name":"Lead foot length","min":410000,"max":890000,"short name":"L","type":"measurement"},"e":{"nom":635000,"long name":"Lead pitch","min":null,"max":null,"short name":"e","type":"measurement"},"PHI":{"nom":4000000,"long name":"Lead angle","min":0,"max":8000000,"short name":"PHI","type":"measurement"},"offset x":{"nom":0,"long name":"X Center offset","min":null,"max":null,"short name":"offset x","type":"measurement"},"offset y":{"nom":0,"long name":"Y Center offset","min":null,"max":null,"short name":"offset y","type":"measurement"},"LS":{"default":"Rounded rectangle","long name":"Land shape","type":"multichoice","short name":"LS"},"LS1":{"default":"Rectangle","long name":"Land shape (Pin 1)","type":"multichoice","short name":"LS1"},"solder toe":{"nom":550000,"long name":"Solder fillet (toe)","min":null,"max":null,"short name":"solder toe","type":"fixedmeasurement"},"solder heel":{"nom":450000,"long name":"Solder fillet (heel)","min":null,"max":null,"short name":"solder heel","type":"fixedmeasurement"},"solder side":{"nom":50000,"long name":"Solder fillet (side)","min":null,"max":null,"short name":"solder side","type":"fixedmeasurement"},"courtyard":{"nom":500000,"long name":"Courtyard","min":null,"max":null,"short name":"courtyard","type":"fixedmeasurement"},"SF":{"default":"A (> 0.625mm pitch)","long name":"Packing level","type":"multichoiceparent","short name":"SF","help":"http://support.upverter.com/customer/portal/articles/978783-what-is-a-footprint-packing-level","children":["solder toe","solder heel","solder side","courtyard"]}}}; FOOTPRINT_PARAMETERS_2: {"fp_type":"PSOP","params":{"N":{"nom":16,"long name":"Number of leads","min":null,"max":null,"short name":"N","type":"count"},"A":{"nom":1600000,"long name":"Height","min":1350000,"max":1750000,"short name":"A","type":"measurement"},"A1":{"nom":169000,"long name":"Package clearance","min":102000,"max":254000,"short name":"A1","type":"measurement"},"A2":{"nom":1431000,"long name":"Package height","min":1096000,"max":1648000,"short name":"A2","type":"measurement"},"D":{"nom":4900000,"long name":"Package length","min":4800000,"max":4980000,"short name":"D","type":"measurement"},"E":{"nom":6000000,"long name":"Width /w leads","min":5840000,"max":6200000,"short name":"E","type":"measurement"},"E1":{"nom":3890000,"long name":"Package width","min":3810000,"max":3990000,"short name":"E1","type":"measurement"},"B":{"nom":250000,"long name":"Lead width","min":200000,"max":300000,"short name":"B","type":"measurement"},"C":{"nom":222000,"long name":"Lead thickness","min":191000,"max":248999,"short name":"C","type":"measurement"},"L":{"nom":640000,"long name":"Lead foot length","min":410000,"max":890000,"short name":"L","type":"measurement"},"e":{"nom":635000,"long name":"Lead pitch","min":null,"max":null,"short name":"e","type":"measurement"},"PHI":{"nom":4000000,"long name":"Lead angle","min":0,"max":8000000,"short name":"PHI","type":"measurement"},"offset x":{"nom":0,"long name":"X Center offset","min":null,"max":null,"short name":"offset x","type":"measurement"},"offset y":{"nom":0,"long name":"Y Center offset","min":null,"max":null,"short name":"offset y","type":"measurement"},"LS":{"default":"Rounded rectangle","long name":"Land shape","type":"multichoice","short name":"LS"},"LS1":{"default":"Rectangle","long name":"Land shape (Pin 1)","type":"multichoice","short name":"LS1"},"solder toe":{"nom":350000,"long name":"Solder fillet (toe)","min":null,"max":null,"short name":"solder toe","type":"fixedmeasurement"},"solder heel":{"nom":350000,"long name":"Solder fillet (heel)","min":null,"max":null,"short name":"solder heel","type":"fixedmeasurement"},"solder side":{"nom":30000,"long name":"Solder fillet (side)","min":null,"max":null,"short name":"solder side","type":"fixedmeasurement"},"courtyard":{"nom":250000,"long name":"Courtyard","min":null,"max":null,"short name":"courtyard","type":"fixedmeasurement"},"SF":{"default":"B (> 0.625mm pitch)","long name":"Packing level","type":"multichoiceparent","short name":"SF","help":"http://support.upverter.com/customer/portal/articles/978783-what-is-a-footprint-packing-level","children":["solder toe","solder heel","solder side","courtyard"]}}}; FOOTPRINT_PARAMETERS_3: {"fp_type":"PSOP","params":{"N":{"nom":16,"long name":"Number of leads","min":null,"max":null,"short name":"N","type":"count"},"A":{"nom":1600000,"long name":"Height","min":1350000,"max":1750000,"short name":"A","type":"measurement"},"A1":{"nom":169000,"long name":"Package clearance","min":102000,"max":254000,"short name":"A1","type":"measurement"},"A2":{"nom":1431000,"long name":"Package height","min":1096000,"max":1648000,"short name":"A2","type":"measurement"},"D":{"nom":4900000,"long name":"Package length","min":4800000,"max":4980000,"short name":"D","type":"measurement"},"E":{"nom":6000000,"long name":"Width /w leads","min":5840000,"max":6200000,"short name":"E","type":"measurement"},"E1":{"nom":3890000,"long name":"Package width","min":3810000,"max":3990000,"short name":"E1","type":"measurement"},"B":{"nom":250000,"long name":"Lead width","min":200000,"max":300000,"short name":"B","type":"measurement"},"C":{"nom":222000,"long name":"Lead thickness","min":191000,"max":248999,"short name":"C","type":"measurement"},"L":{"nom":640000,"long name":"Lead foot length","min":410000,"max":890000,"short name":"L","type":"measurement"},"e":{"nom":635000,"long name":"Lead pitch","min":null,"max":null,"short name":"e","type":"measurement"},"PHI":{"nom":4000000,"long name":"Lead angle","min":0,"max":8000000,"short name":"PHI","type":"measurement"},"offset x":{"nom":0,"long name":"X Center offset","min":null,"max":null,"short name":"offset x","type":"measurement"},"offset y":{"nom":0,"long name":"Y Center offset","min":null,"max":null,"short name":"offset y","type":"measurement"},"LS":{"default":"Rounded rectangle","long name":"Land shape","type":"multichoice","short name":"LS"},"LS1":{"default":"Rectangle","long name":"Land shape (Pin 1)","type":"multichoice","short name":"LS1"},"solder toe":{"nom":150000,"long name":"Solder fillet (toe)","min":null,"max":null,"short name":"solder toe","type":"fixedmeasurement"},"solder heel":{"nom":250000,"long name":"Solder fillet (heel)","min":null,"max":null,"short name":"solder heel","type":"fixedmeasurement"},"solder side":{"nom":10000,"long name":"Solder fillet (side)","min":null,"max":null,"short name":"solder side","type":"fixedmeasurement"},"courtyard":{"nom":100000,"long name":"Courtyard","min":null,"max":null,"short name":"courtyard","type":"fixedmeasurement"},"SF":{"default":"C (> 0.625mm pitch)","long name":"Packing level","type":"multichoiceparent","short name":"SF","help":"http://support.upverter.com/customer/portal/articles/978783-what-is-a-footprint-packing-level","children":["solder toe","solder heel","solder side","courtyard"]}}}; FOOTPRINT_URL: https://pdfserv.maximintegrated.com/land_patterns/90-0167.PDF; FOOTPRINT_VARIANT_NAME_0: Recommended_Land_Pattern; FOOTPRINT_VARIANT_NAME_1: IPC_A; FOOTPRINT_VARIANT_NAME_2: IPC_B; FOOTPRINT_VARIANT_NAME_3: IPC_C; HEIGHT: 1.75mm; IPC_LAND_PATTERN_NAME: SOP64P600X160-16; LEAD_FREE: Yes; MAX_DUTY_CYCLE: 95%; MAX_JUNCTION_TEMP: +150°C; MAX_POWER_DISSIPATION: 1W; MAX_SUPPLY_VOLTAGE: 28V; MF: Maxim; MFG_PACKAGE_IDENT: E16-8F; MFG_PACKAGE_IDENT_COMPONENT_ID: 56e589de25e1f22b; MFG_PACKAGE_IDENT_DATE: 0; MFG_PACKAGE_IDENT_REV: R; MIN_SUPPLY_VOLTAGE: 3V; MOUSER_PART_NUMBER: 700-MAX618EEE; MPN: MAX618EEE+; NOMINAL_SUPPLY_CURRENT: 500-5000uA; NUMBER_OF_OUTPUTS: 1; OUTPUT_CURRENT: 0.5A; OUTPUT_TYPE: AdjustableProgrammable; OUTPUT_VOLTAGE: 3-28V; PACKAGE: QSOP16; PREFIX: U; ROHS: Yes; STANDOFF_HEIGHT: 0.102mm; SWITCHING_FREQUENCY: 250kHz; SWITCHING_TOPOLOGY: Boost; TEMPERATURE_RANGE_HIGH: +85°C; TEMPERATURE_RANGE_LOW: -40°C; VERIFICATION_VERSION: 0.0.0.3
U$4 = microbuilder:ATSAMD21J
X1 = microbuilder:CON_JST_PH_2PIN: JST 2-Pin Right-Angle Connector PH-Series - 4UConnector: 17311 SH-Series - 4UConnector: 07278
X2 = adafruit2:XTAL: Low cost SMT crystals, no capacitors included http://www.ladyada.net/library/eagle
X3 = microbuilder:USB: USB Connectors USBMINIB - Surface Mount Female Mini-B USB Connector 4UConnector: 06564
X4 = microbuilder:ANTENNA_U.FL: U.FL Antenna Connector